# Altium schematic sheet BlockDiagram.SchDoc
size A4; SheetNumber: 1; SheetTotal: 5
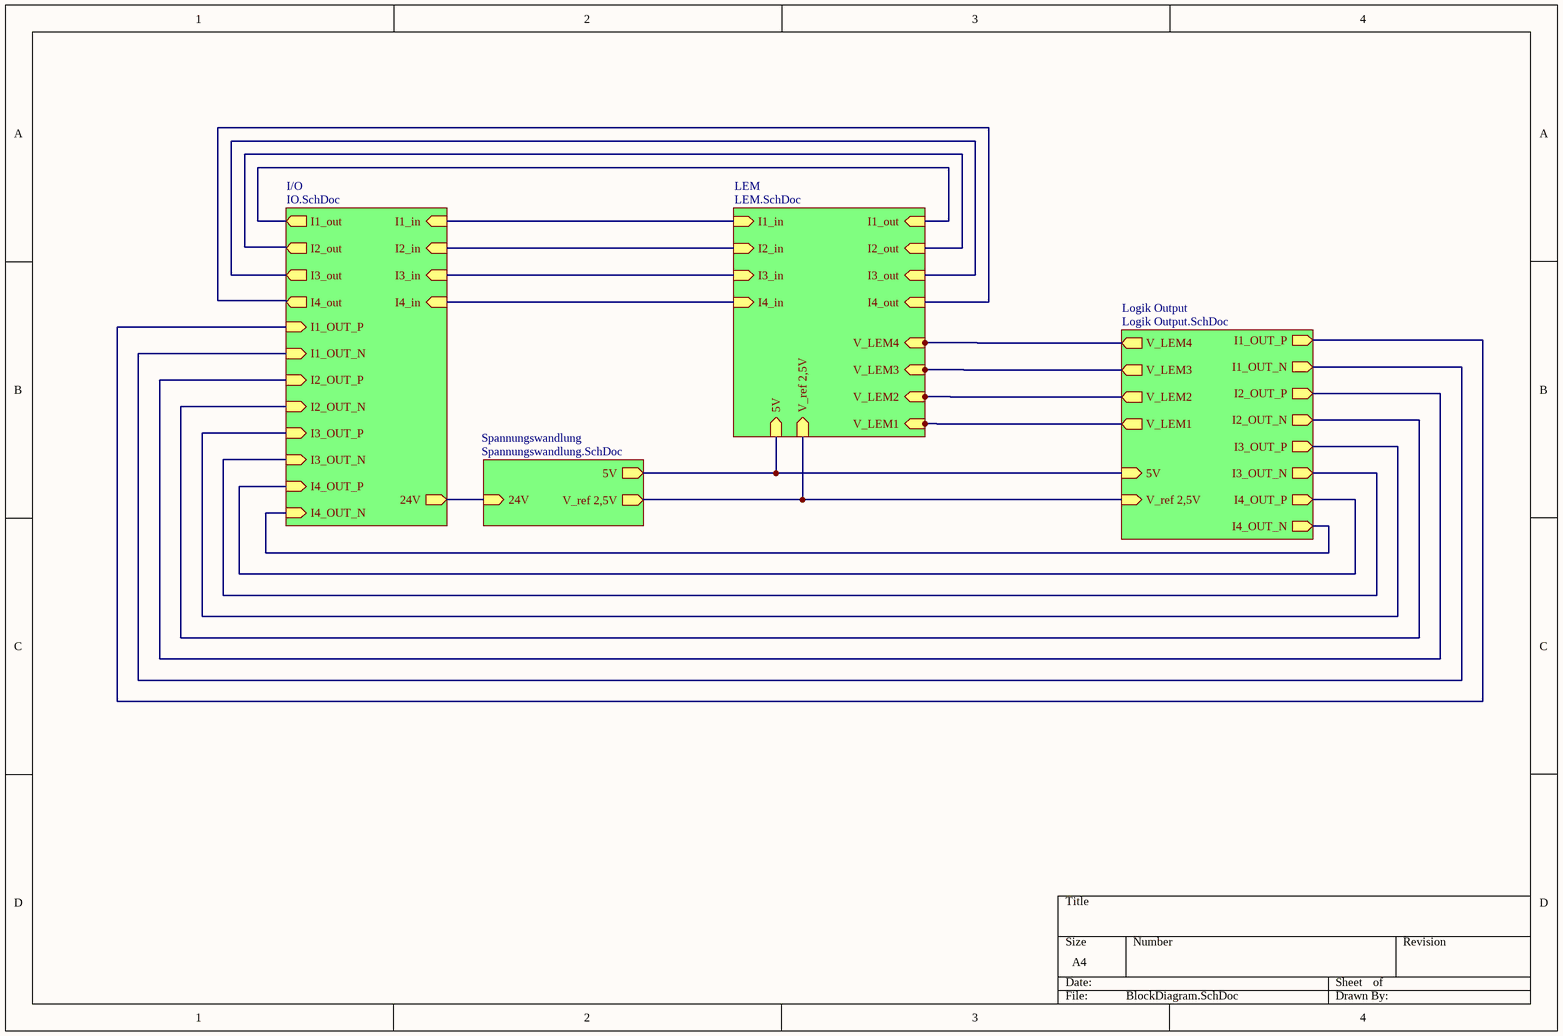
[diagram p0: BlockDiagram.SchDoc]

## Sub-sheets
I/O = IO.SchDoc: I1_out (out), I1_in (in), 24V (out), I2_in (in), I3_in (in), I4_in (in), I2_out (out), I3_out (out), I4_out (out), I1_OUT_P (in), I1_OUT_N (in), I2_OUT_P (in), I2_OUT_N (in), I3_OUT_P (in), I3_OUT_N (in), I4_OUT_P (in), I4_OUT_N (in)
LEM = LEM.SchDoc: I1_in (in), 5V (in), I1_out (in), V_LEM1 (in), V_LEM2 (in), V_LEM3 (in), V_LEM4 (in), I2_in (in), I3_in (in), I4_in (in), I4_out (in), I2_out (in), I3_out (in), V_ref 2,5V (in)
Logik Output = Logik Output.SchDoc: V_LEM1 (out), 5V (in), V_ref 2,5V (in), V_LEM2 (out), V_LEM3 (out), V_LEM4 (out), I1_OUT_P (out), I1_OUT_N (out), I2_OUT_P (out), I2_OUT_N (out), I3_OUT_P (out), I3_OUT_N (out), I4_OUT_P (out), I4_OUT_N (out)
Spannungswandlung = Spannungswandlung.SchDoc: 24V (in), 5V (out), V_ref 2,5V (out)

## Nets
(unnamed): sheet LEM/I1_in, sheet I/O/I1_in
(unnamed): sheet LEM/5V, sheet Spannungswandlung/5V, sheet Logik Output/5V
(unnamed): sheet LEM/I1_out, sheet I/O/I1_out
(unnamed): sheet LEM/V_LEM1, sheet Logik Output/V_LEM1
(unnamed): sheet LEM/V_LEM2, sheet Logik Output/V_LEM2
(unnamed): sheet LEM/V_LEM3, sheet Logik Output/V_LEM3
(unnamed): sheet LEM/V_LEM4, sheet Logik Output/V_LEM4
(unnamed): sheet LEM/I2_in, sheet I/O/I2_in
(unnamed): sheet LEM/I3_in, sheet I/O/I3_in
(unnamed): sheet LEM/I4_in, sheet I/O/I4_in
(unnamed): sheet LEM/I4_out, sheet I/O/I4_out
(unnamed): sheet LEM/I2_out, sheet I/O/I2_out
(unnamed): sheet LEM/I3_out, sheet I/O/I3_out
(unnamed): sheet LEM/V_ref 2,5V, sheet Spannungswandlung/V_ref 2,5V, sheet Logik Output/V_ref 2,5V
(unnamed): sheet I/O/24V, sheet Spannungswandlung/24V
(unnamed): sheet I/O/I1_OUT_P, sheet Logik Output/I1_OUT_P
(unnamed): sheet I/O/I1_OUT_N, sheet Logik Output/I1_OUT_N
(unnamed): sheet I/O/I2_OUT_P, sheet Logik Output/I2_OUT_P
(unnamed): sheet I/O/I2_OUT_N, sheet Logik Output/I2_OUT_N
(unnamed): sheet I/O/I3_OUT_P, sheet Logik Output/I3_OUT_P
(unnamed): sheet I/O/I3_OUT_N, sheet Logik Output/I3_OUT_N
(unnamed): sheet I/O/I4_OUT_P, sheet Logik Output/I4_OUT_P
(unnamed): sheet I/O/I4_OUT_N, sheet Logik Output/I4_OUT_N